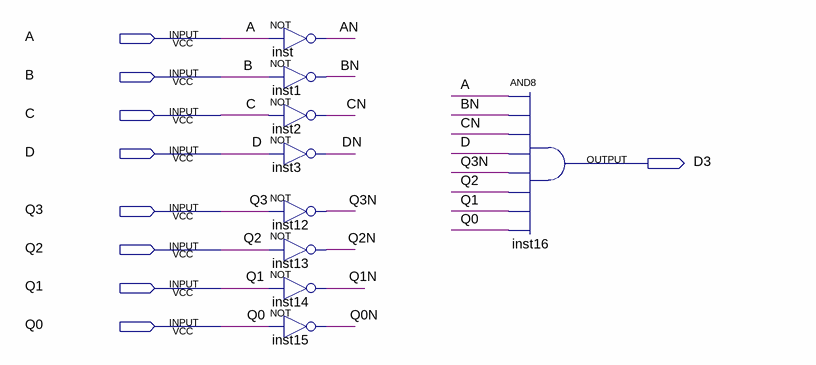
[diagram p0: schematic sheet]
// Quartus schematic D3.bdf as structural Verilog: 9 symbols, 9 pins
module D3 (
  input  A,
  input  B,
  input  C,
  input  D,
  input  Q3,
  input  Q2,
  input  Q1,
  input  Q0,
  output D3
);

  wire AN, BN, CN, DN, Q0N, Q1N, Q2N, Q3N;

  not inst (AN, A);
  not inst1 (BN, B);
  not inst2 (CN, C);
  not inst3 (DN, D);
  not inst12 (Q3N, Q3);
  not inst13 (Q2N, Q2);
  not inst14 (Q1N, Q1);
  not inst15 (Q0N, Q0);
  and inst16 (D3, A, BN, CN, D, Q3N, Q2, Q1, Q0);
endmodule
